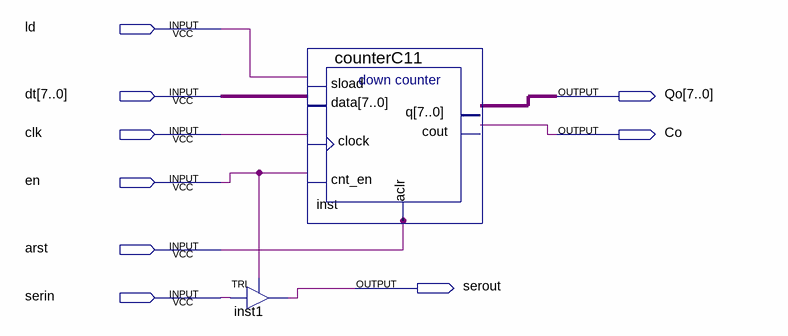
[diagram p0: schematic sheet]
// Quartus schematic downcounter.bdf as structural Verilog: 2 symbols, 9 pins
module downcounter (
  input  ld,
  input  [7:0] dt,
  input  clk,
  input  en,
  input  arst,
  input  serin,
  output [7:0] Qo,
  output Co,
  output serout
);

  TRI inst1 (.IN(serin), .OE(en), .OUT(serout));
  counterC11 inst (.aclr(arst));  // open: sload, data, clock, cnt_en, cout, q
endmodule
